# Altium schematic sheet Half_Slave.SchDoc
size A
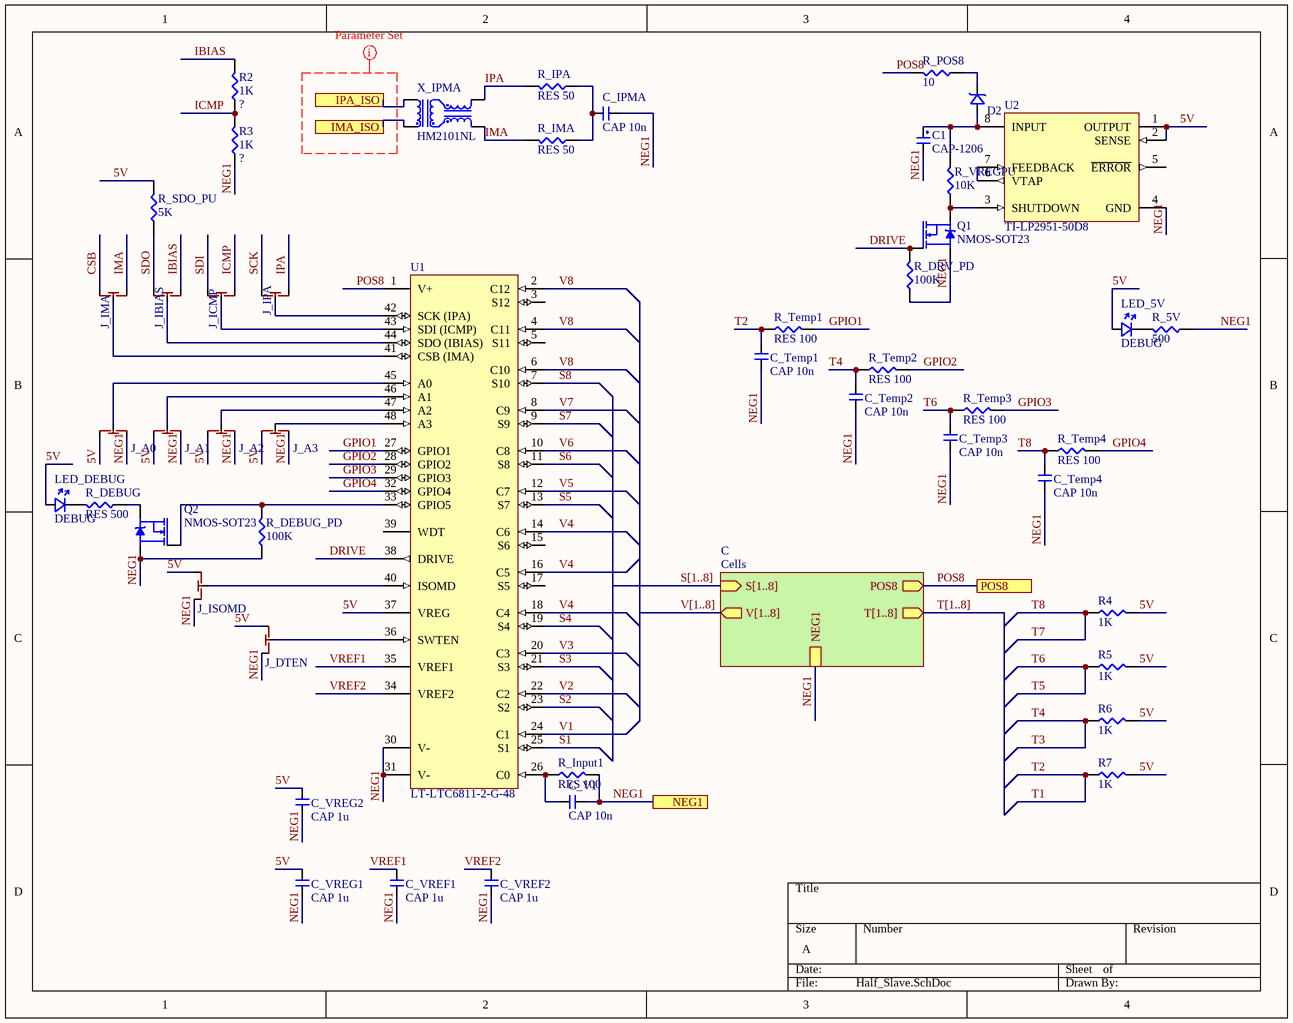
[diagram p0: Half_Slave.SchDoc]

## Parts
C1  CAP-1206  [CAPCP3216X16N]
C_IPMA  CAP 10n  [CAP-0603]
C_Temp1  CAP 10n  [CAP-0603]
C_Temp2  CAP 10n  [CAP-0603]
C_Temp3  CAP 10n  [CAP-0603]
C_Temp4  CAP 10n  [CAP-0603]
C_V1  CAP 10n  [CAP-0603]
C_VREF1  CAP 1u  [CAP-0603]
C_VREF2  CAP 1u  [CAP-0603]
C_VREG1  CAP 1u  [CAP-0603]
C_VREG2  CAP 1u  [CAP-0603]
D2  ?  [SMB]  (value not drawn)
J_A0  DPDT Solder Jumper  [DPDT Solder]  (value not drawn)
J_A1  DPDT Solder Jumper  [DPDT Solder]  (value not drawn)
J_A2  DPDT Solder Jumper  [DPDT Solder]  (value not drawn)
J_A3  DPDT Solder Jumper  [DPDT Solder]  (value not drawn)
J_DTEN  DPDT Solder Jumper  [DPDT Solder]  (value not drawn)
J_IBIAS  DPDT Solder Jumper  [DPDT Solder]  (value not drawn)
J_ICMP  DPDT Solder Jumper  [DPDT Solder]  (value not drawn)
J_IMA  DPDT Solder Jumper  [DPDT Solder]  (value not drawn)
J_IPA  DPDT Solder Jumper  [DPDT Solder]  (value not drawn)
J_ISOMD  DPDT Solder Jumper  [DPDT Solder]  (value not drawn)
LED_5V  DEBUG  [LED-0603]
LED_DEBUG  DEBUG  [LED-0603]
Q1  NMOS-SOT23  [SOT23]
Q2  NMOS-SOT23  [SOT23]
R2  1K  [RES-0603]
R3  1K  [RES-0603]
R4  1K  [RES-0603]
R5  1K  [RES-0603]
R6  1K  [RES-0603]
R7  1K  [RES-0603]
R_5V  500  [RES-0603]
R_DEBUG  RES 500  [RES-0603]
R_DEBUG_PD  100K  [RES-0603]
R_DRV_PD  100K  [RES-0603]
R_IMA  RES 50  [RES-0603]
R_Input1  RES 100  [RES-0603]
R_IPA  RES 50  [RES-0603]
R_POS8  10  [RES-0603]
R_SDO_PU  5K  [RES-0603]
R_Temp1  RES 100  [RES-0603]
R_Temp2  RES 100  [RES-0603]
R_Temp3  RES 100  [RES-0603]
R_Temp4  RES 100  [RES-0603]
R_VREGPU  10K  [RES-0603]
U1  LT-LTC6811-2-G-48  [SSOP-48N]
U2  TI-LP2951-50D8  [SOIC127P600X175-8N]
X_IPMA  HM2101NL  [HM2101]

## Sub-sheets
C = Cells: S[1..8] (in), POS8 (out), T[1..8] (out), V[1..8] (out), NEG1

## Ports
IMA_ISO, IPA_ISO, NEG1, POS8

## Nets
5V: C_VREG1.2 C_VREG2.2 J_A0.2 J_A1.2 J_A2.2 J_A3.2 J_DTEN.2 J_ISOMD.2 LED_5V.A LED_DEBUG.A R4.2 R5.2 R6.2 R7.2 R_SDO_PU.2 U1.37(VREG) U2.1(OUTPUT) U2.2(SENSE)
CSB: J_IMA.1
DRIVE: Q1.1(G) R_DRV_PD.2 U1.38(DRIVE)
GPIO1: R_Temp1.2 U1.27(GPIO1)
GPIO2: R_Temp2.2 U1.28(GPIO2)
GPIO3: R_Temp3.2 U1.29(GPIO3)
GPIO4: R_Temp4.2 U1.32(GPIO4)
IBIAS: J_IBIAS.2 R2.2
ICMP: J_ICMP.2 R2.1 R3.2
IMA: J_IMA.2 R_IMA.2 X_IPMA.4
IMA_ISO: X_IPMA.3 ; port IMA_ISO
IPA: J_IPA.2 R_IPA.2 X_IPMA.6
IPA_ISO: X_IPMA.1 ; port IPA_ISO
NEG1: C1.2 C_IPMA.1 C_Temp1.1 C_Temp2.1 C_Temp3.1 C_Temp4.1 C_V1.1 C_VREF1.1 C_VREF2.1 C_VREG1.1 C_VREG2.1 J_A0.1 J_A1.1 J_A2.1 J_A3.1 J_DTEN.1 J_ISOMD.1 Q1.2(S) Q2.2(S) R3.1 R_5V.1 R_DEBUG_PD.1 R_DRV_PD.1 R_Input1.2 U1.30(V-) U1.31(V-) U2.4(GND) ; port NEG1, sheet C/NEG1
POS8: R_POS8.2 U1.1(V+) ; port POS8, sheet C/POS8
S1: U1.25(S1)
S2: U1.23(S2)
S3: U1.21(S3)
S4: U1.19(S4)
S5: U1.13(S7)
S6: U1.11(S8)
S7: U1.9(S9)
S8: U1.7(S10)
SCK: J_IPA.1
SDI: J_ICMP.1
SDO: J_IBIAS.1 R_SDO_PU.1
T1: C_Temp1.2 R7.1 R_Temp1.1  [also labelled T2]
T3: C_Temp2.2 R6.1 R_Temp2.1  [also labelled T4]
T5: C_Temp3.2 R5.1 R_Temp3.1  [also labelled T6]
T7: C_Temp4.2 R4.1 R_Temp4.1  [also labelled T8]
V1: U1.24(C1)
V2: U1.22(C2)
V3: U1.20(C3)
V4: U1.14(C6) U1.16(C5) U1.18(C4)
V5: U1.12(C7)
V6: U1.10(C8)
V7: U1.8(C9)
V8: U1.2(C12) U1.4(C11) U1.6(C10)
VREF1: C_VREF1.2 U1.35(VREF1)
VREF2: C_VREF2.2 U1.34(VREF2)
NetC1_1: C1.1 D2.A R_VREGPU.2 U2.8(INPUT)
NetC_IPMA_2: C_IPMA.2 R_IMA.1 R_IPA.1
NetC_V1_2: C_V1.2 R_Input1.1 U1.26(C0)
NetD2_K: D2.K R_POS8.1
NetJ_A0_3: J_A0.3 U1.45(A0)
NetJ_A1_3: J_A1.3 U1.46(A1)
NetJ_A2_3: J_A2.3 U1.47(A2)
NetJ_A3_3: J_A3.3 U1.48(A3)
NetJ_DTEN_3: J_DTEN.3 U1.36(SWTEN)
NetJ_IBIAS_3: J_IBIAS.3 U1.44(SDO_(IBIAS))
NetJ_ICMP_3: J_ICMP.3 U1.43(SDI_(ICMP))
NetJ_IMA_3: J_IMA.3 U1.41(CSB_(IMA))
NetJ_IPA_3: J_IPA.3 U1.42(SCK_(IPA))
NetJ_ISOMD_3: J_ISOMD.3 U1.40(ISOMD)
NetLED_5V_K: LED_5V.K R_5V.2
NetLED_DEBUG_K: LED_DEBUG.K R_DEBUG.2
NetQ1_3: Q1.3(D) R_VREGPU.1 U2.3(SHUTDOWN)
NetQ2_1: Q2.1(G) R_DEBUG_PD.2 U1.33(GPIO5)
NetQ2_3: Q2.3(D) R_DEBUG.1
NetU2_6: U2.6(VTAP) U2.7(FEEDBACK)

Not connected (* = marked no-connect by the designer): U1 3(S12) 5(S11) 15(S6) 17(S5) 39(WDT); U2 5(~{ERROR})

## Buses and harness runs
bus S[1..8] = sheet C/S[1..8]
bus T[1..8] = sheet C/T[1..8]
bus V[1..8] = sheet C/V[1..8]

## Layout directives
rule Clearance Constraint [Clearance = 32mil]; net class ISO: (no net found under the mark)

## Library data of the parts
C_IPMA C_Temp1-C_Temp4 C_V1 C_VREF1 C_VREF2 C_VREG1 C_VREG2 = CAP-0603
D2 = DIODE-SMB
J_A0-J_A3 J_DTEN J_IBIAS J_ICMP J_IMA J_IPA J_ISOMD = DPDT Solder
LED_5V LED_DEBUG = LED-0603
R2 R3 = RES_0603: RES SMD 0603; Company: IFE; Part: RES_0603; Value: ?; Package: 0603
R4-R7 R_5V R_DEBUG R_DEBUG_PD R_DRV_PD R_IMA R_Input1 R_IPA R_POS8 R_SDO_PU R_Temp1-R_Temp4 R_VREGPU = RES-0603